# Altium schematic sheet playC.SchDoc
size A3
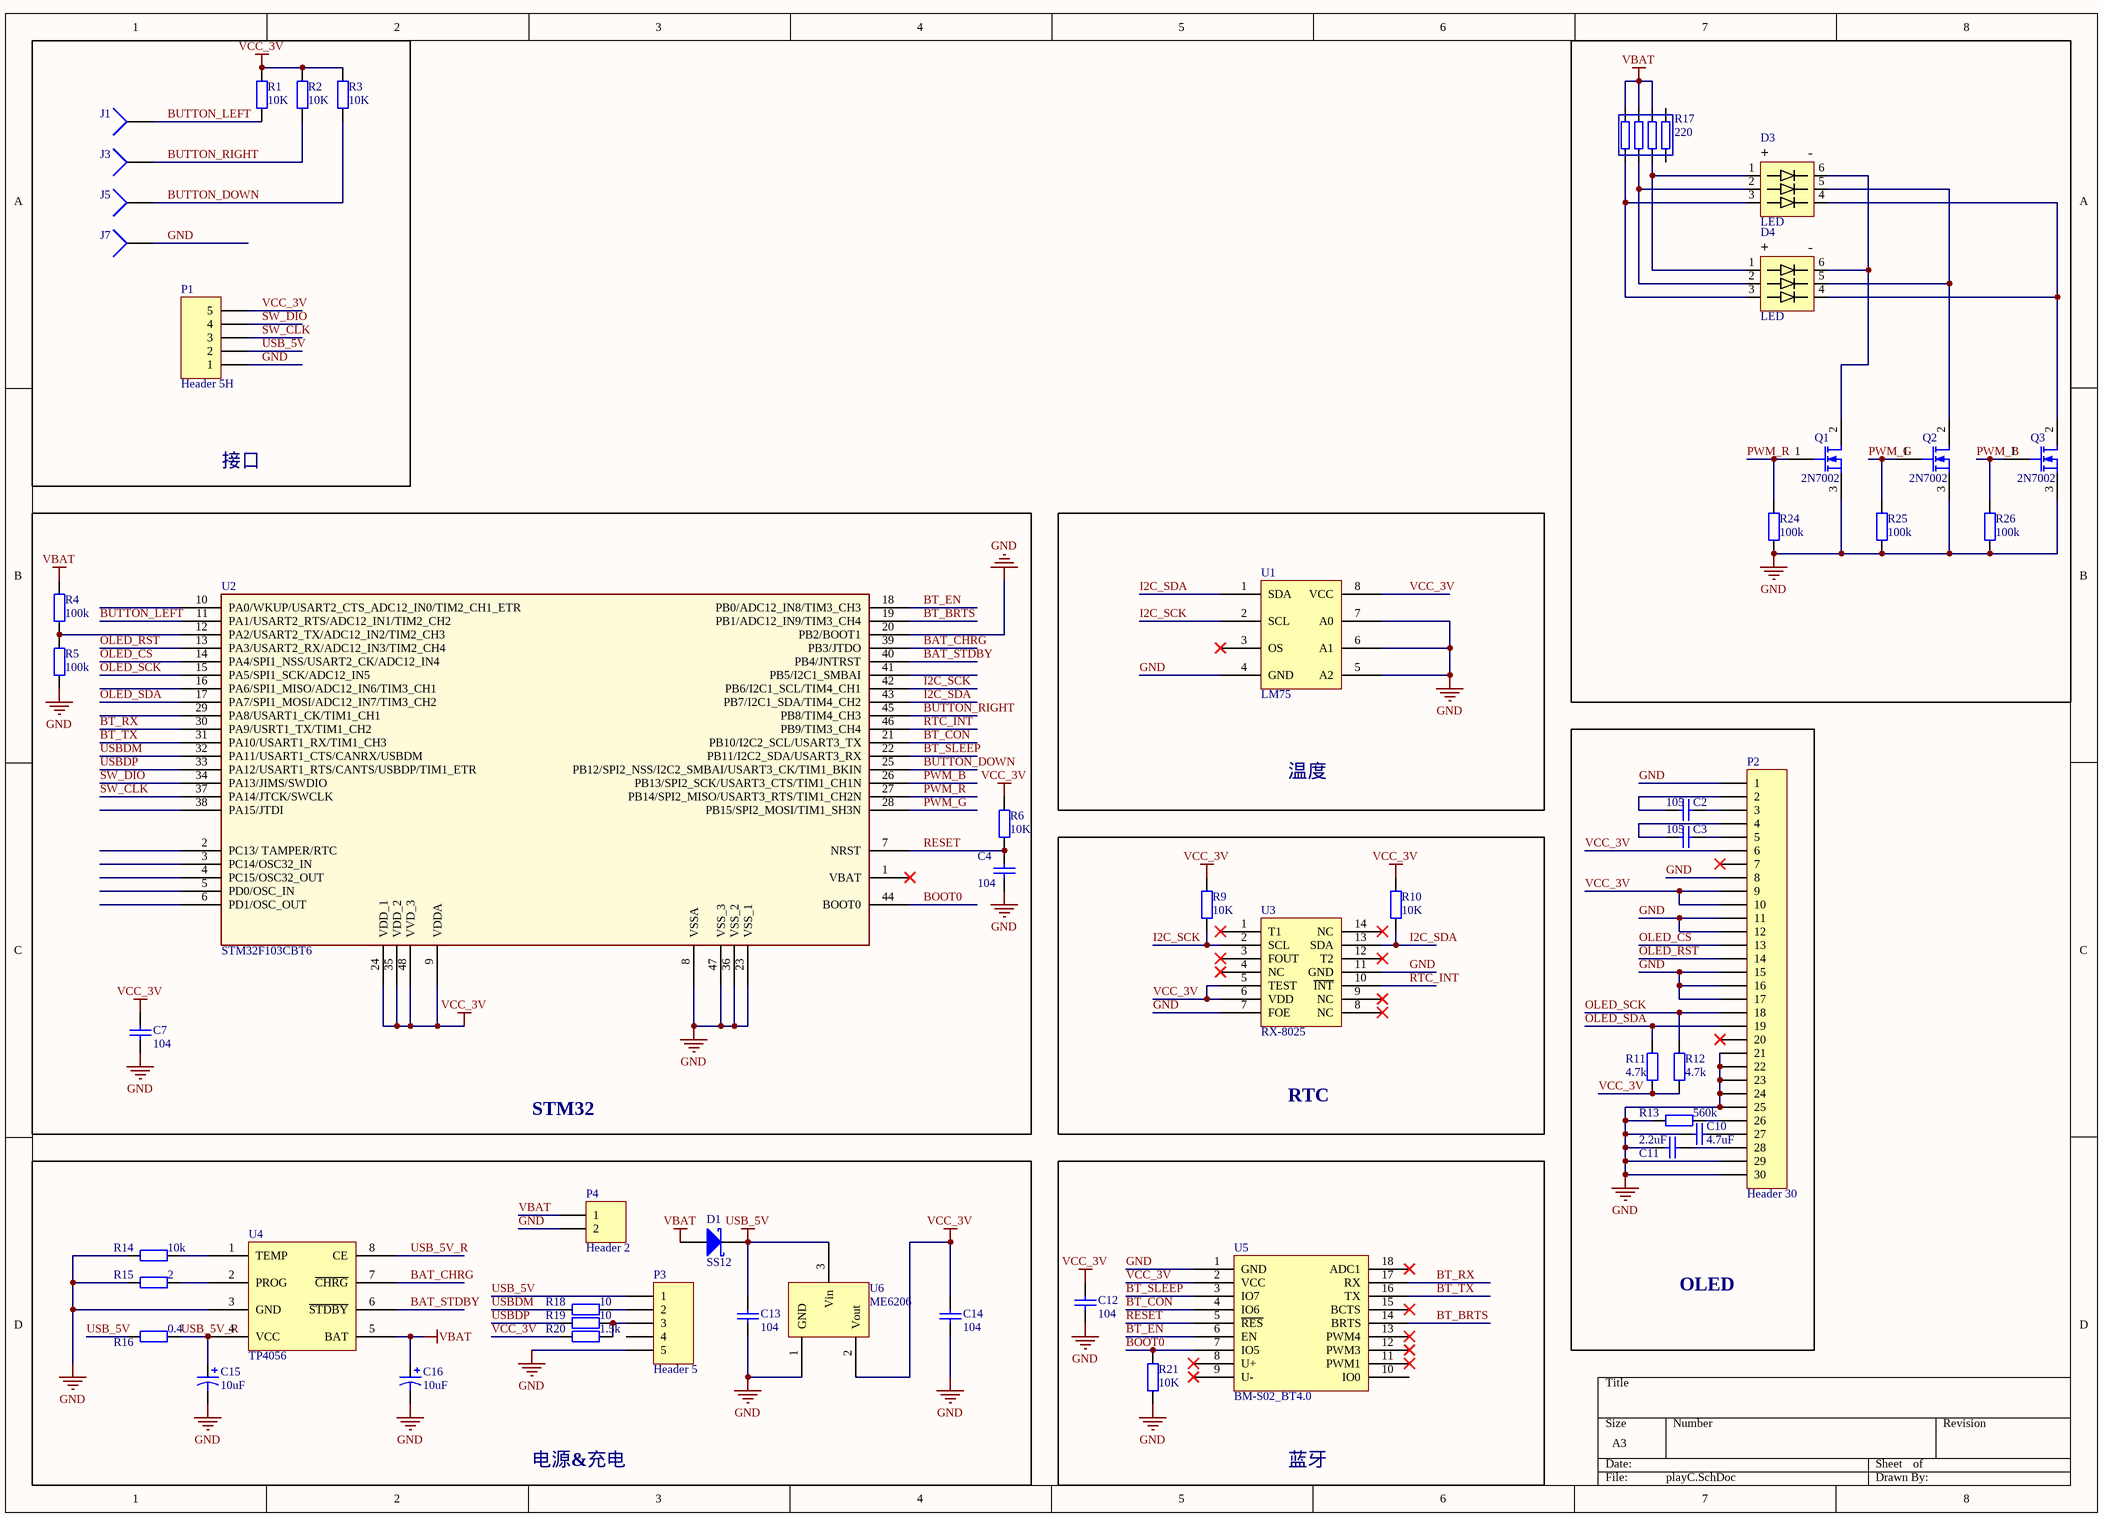
[diagram p0: playC.SchDoc]

## Parts
C2  105  [0603]
C3  105  [0603]
C4  104  [0603]
C7  104  [0603]
C10  4.7uF  [0805]
C11  2.2uF  [0805]
C12  104  [0603]
C13  104  [0603]
C14  104  [0603]
C15  10uF  [Cap_Tan_B]
C16  10uF  [Cap_Tan_B]
D1  SS12  [SMA]
D3  LED  [5050_LED]
D4  LED  [5050_LED]
J1  PAD  [LINK_HOLE]  (value not drawn)
J3  PAD  [LINK_HOLE]  (value not drawn)
J5  PAD  [LINK_HOLE]  (value not drawn)
J7  PAD  [LINK_HOLE]  (value not drawn)
P1  Header 5H  [connect_5pin]
P2  Header 30  [OLED(30PIN_1.3')]
P3  Header 5  [Mini_USB_IN]
P4  Header 2  [HDR1X2]
Q1  2N7002  [SOT23]
Q2  2N7002  [SOT23]
Q3  2N7002  [SOT23]
R1  10K  [0603]
R2  10K  [0603]
R3  10K  [0603]
R4  100k  [0603]
R5  100k  [0603]
R6  10K  [0603]
R9  10K  [0603]
R10  10K  [0603]
R11  4.7k  [0603]
R12  4.7k  [0603]
R13  560k  [0603]
R14  10k  [0603]
R15  2  [0603]
R16  0.4  [1206]
R17  220  [0603_4]
R18  10  [0603]
R19  10  [0603]
R20  1.5k  [0603]
R21  10K  [0603]
R24  100k  [0603]
R25  100k  [0603]
R26  100k  [0603]
U1  LM75  [SOIC-8]
U2  STM32F103CBT6  [LQFP48_N]
U3  RX-8025  [SOP-14]
U4  TP4056  [TP4056]
U5  BM-S02_BT4.0  [BM_S02_Bluetooth4.0]
U6  ME6206  [BAT54-S]

## Blocks framed on the sheet
接口: J1 J3 J5 J7 P1 R1-R3
STM32: C4 C7 R4-R6 U2
OLED: C2 C3 C10 C11 P2 R11-R13
RTC: R9 R10 U3
电源&充电: C13-C16 D1 P3 P4 R14-R16 R18-R20 U4 U6
蓝牙: C12 R21 U5

## Nets
GND: C4.1 C7.1 C10.2 C11.2 C12.1 C13.1 C14.1 C15.2 C16.2 J7.1 P1.1 P2.1 P2.8 P2.11 P2.12 P2.15 P2.16 P2.17 P2.21 P2.22 P2.23 P2.24 P2.25 P2.29 P2.30 P3.5 P4.2 Q1.3(S) Q2.3(S) Q3.3(S) R5.2 R13.2 R14.2 R15.2 R21.1 R24.1 R25.1 R26.1 U1.4(GND) U1.5(A2) U1.6(A1) U1.7(A0) U2.8(VSSA) U2.20(PB2/BOOT1) U2.23(VSS_1) U2.36(VSS_2) U2.47(VSS_3) U3.7(FOE) U3.11(GND) U4.3(GND) U5.1(GND) U6.1(GND)
USB_5V: C13.2 D1.2(K) P1.2 P3.1 R16.2 U6.3(Vin)
VBAT: C16.1 D1.1(A) P4.1 R4.1 R17.5 R17.6 R17.7 U4.5(BAT)
VCC_3V: C7.2 C12.2 C14.2 P1.5 P2.6 P2.9 P2.10 R1.2 R2.2 R3.2 R6.2 R9.2 R10.2 R11.2 R12.2 R20.2 U1.8(VCC) U2.9(VDDA) U2.24(VDD_1) U2.35(VDD_2) U2.48(VVD_3) U3.5(TEST) U3.6(VDD) U5.2(VCC) U6.2(Vout)
BAT_CHRG: U2.39(PB3/JTDO) U4.7(~{CHRG})
BAT_STDBY: U2.40(PB4/JNTRST) U4.6(~{STDBY})
BOOT0: R21.2 U2.44(BOOT0) U5.7(IO5)
BT_BRTS: U2.19(PB1/ADC12_IN9/TIM3_CH4) U5.14(BRTS)
BT_CON: U2.21(PB10/I2C2_SCL/USART3_TX) U5.4(IO6)
BT_EN: U2.18(PB0/ADC12_IN8/TIM3_CH3) U5.6(EN)
BT_RX: U2.30(PA9/USRT1_TX/TIM1_CH2) U5.17(RX)
BT_SLEEP: U2.22(PB11/I2C2_SDA/USART3_RX) U5.3(IO7)
BT_TX: U2.31(PA10/USART1_RX/TIM1_CH3) U5.16(TX)
BUTTON_DOWN: J5.1 R3.1 U2.25(PB12/SPI2_NSS/I2C2_SMBAI/USART3_CK/TIM1_BKIN)
BUTTON_LEFT: J1.1 R1.1 U2.11(PA1/USART2_RTS/ADC12_IN1/TIM2_CH2)
BUTTON_RIGHT: J3.1 R2.1 U2.45(PB8/TIM4_CH3)
I2C_SCK: R9.1 U1.2(SCL) U2.42(PB6/I2C1_SCL/TIM4_CH1) U3.2(SCL)
I2C_SDA: R10.1 U1.1(SDA) U2.43(PB7/I2C1_SDA/TIM4_CH2) U3.13(SDA)
OLED_CS: P2.13 U2.14(PA4/SPI1_NSS/USART2_CK/ADC12_IN4)
OLED_RST: P2.14 U2.13(PA3/USART2_RX/ADC12_IN3/TIM2_CH4)
OLED_SCK: P2.18 R12.1 U2.15(PA5/SPI1_SCK/ADC12_IN5)
OLED_SDA: P2.19 R11.1 U2.17(PA7/SPI1_MOSI/ADC12_IN7/TIM3_CH2)
PWM_B: Q3.1(G) R26.2 U2.26(PB13/SPI2_SCK/USART3_CTS/TIM1_CH1N)
PWM_G: Q2.1(G) R25.2 U2.28(PB15/SPI2_MOSI/TIM1_SH3N)
PWM_R: Q1.1(G) R24.2 U2.27(PB14/SPI2_MISO/USART3_RTS/TIM1_CH2N)
RESET: C4.2 R6.1 U2.7(NRST) U5.5(~{RES})
RTC_INT: U2.46(PB9/TIM3_CH4) U3.10(~{INT})
SW_CLK: P1.3 U2.37(PA14/JTCK/SWCLK)
SW_DIO: P1.4 U2.34(PA13/JIMS/SWDIO)
USB_5V_R: C15.1 R16.1 U4.4(VCC) U4.8(CE)
USBDM: R18.2 U2.32(PA11/USART1_CTS/CANRX/USBDM)
USBDP: R19.2 U2.33(PA12/USART1_RTS/CANTS/USBDP/TIM1_ETR)
NetC2_1: C2.1 P2.3
NetC2_2: C2.2 P2.2
NetC3_1: C3.1 P2.5
NetC3_2: C3.2 P2.4
NetC10_1: C10.1 P2.27
NetC11_1: C11.1 P2.28
NetD3_1: D3.1 D4.1 R17.2
NetD3_2: D3.2 D4.2 R17.3
NetD3_3: D3.3 D4.3 R17.4
NetD3_4: D3.4 D4.4 Q3.2(D)
NetD3_5: D3.5 D4.5 Q2.2(D)
NetD3_6: D3.6 D4.6 Q1.2(D)
NetP2_26: P2.26 R13.1
NetP3_2: P3.2 R18.1
NetP3_3: P3.3 R19.1 R20.1
NetR4_2: R4.2 R5.1 U2.12(PA2/USART2_TX/ADC12_IN2/TIM2_CH3)
NetR14_1: R14.1 U4.1(TEMP)
NetR15_1: R15.1 U4.2(PROG)

Not connected (* = marked no-connect by the designer): P2 7* 20*; P3 4; R17 1 8; U1 3(OS)*; U2 1(VBAT)* 2(PC13/_TAMPER/RTC) 3(PC14/OSC32_IN) 4(PC15/OSC32_OUT) 5(PD0/OSC_IN) 6(PD1/OSC_OUT) 10(PA0/WKUP/USART2_CTS_ADC12_IN0/TIM2_CH1_ETR) 16(PA6/SPI1_MISO/ADC12_IN6/TIM3_CH1) 29(PA8/USART1_CK/TIM1_CH1) 38(PA15/JTDI) 41(PB5/I2C1_SMBAI); U3 1(T1)* 3(FOUT)* 4(NC)* 8(NC)* 9(NC)* 12(T2)* 14(NC)*; U5 8(U+)* 9(U-)* 10(IO0) 11(PWM1)* 12(PWM3)* 13(PWM4)* 15(BCTS)* 18(ADC1)*

## Notes on the sheet
- 温度
- (in symbol LED_6Pin) +; -

## Library data of the parts
C2-C4 C7 C10-C14 = Cap: Capacitor; Value: 100pF; Published: 8-Jun-2000; LatestRevisionDate: 17-Jul-2002; LatestRevisionNote: Re-released for DXP Platform.; PackageReference: RAD-0.3; Publisher: Altium Limited
C15 C16 = Cap Pol1: Polarized Capacitor (Radial); Published: 8-Jun-2000; LatestRevisionDate: 17-Jul-2002; LatestRevisionNote: Re-released for DXP Platform.; PackageReference: RB7.6-15; Publisher: Altium Limited; Value: 10uF
D1 = D Schottky: Schottky Diode; Published: 8-Jun-2000; LatestRevisionDate: 17-Jul-2002; LatestRevisionNote: Re-released for DXP Platform.; PackageReference: SMB; Publisher: Altium Limited; Code_JEDEC: DO-214-AA
D3 D4 = LED_6Pin
J1 J3 J5 J7 = Socket: LatestRevisionDate: 17-Jul-2002; LatestRevisionNote: Re-released for DXP Platform.; Publisher: Altium Limited
P1 = Header 5H: Header, 5-Pin, Right Angle; LatestRevisionDate: 17-Jul-2002; LatestRevisionNote: Re-released for DXP Platform.; Publisher: Altium Limited
P2 = Header 30: Header, 30-Pin; LatestRevisionDate: 17-Jul-2002; LatestRevisionNote: Re-released for DXP Platform.; Publisher: Altium Limited
P3 = Header 5: Header, 5-Pin; LatestRevisionDate: 17-Jul-2002; LatestRevisionNote: Re-released for DXP Platform.; Publisher: Altium Limited
P4 = Header 2: Header, 2-Pin; LatestRevisionDate: 17-Jul-2002; LatestRevisionNote: Re-released for DXP Platform.; Publisher: Altium Limited
Q1-Q3 = MOSFET-N: N-Channel MOSFET; PackageDocument: 1995/1996; Published: 8-Jun-2000; LatestRevisionDate: 17-Jul-2002; LatestRevisionNote: Re-released for DXP Platform.; PackageReference: E3; Publisher: Altium Limited
R1-R3 R6 R9 R10 R14 R21 = Res2: Resistor; Published: 8-Jun-2000; LatestRevisionDate: 17-Jul-2002; LatestRevisionNote: Re-released for DXP Platform.; PackageReference: AXIAL-0.4; Publisher: Altium Limited; Value: 10K
R4 R5 R11-R13 R15 R16 R18-R20 R24-R26 = Res2: Resistor; Value: 10K; Published: 8-Jun-2000; LatestRevisionDate: 17-Jul-2002; LatestRevisionNote: Re-released for DXP Platform.; PackageReference: AXIAL-0.4; Publisher: Altium Limited
R17 = RES_SELF_4
U3 = RX-8025T